# Altium project PCB_Start.PrjPcb
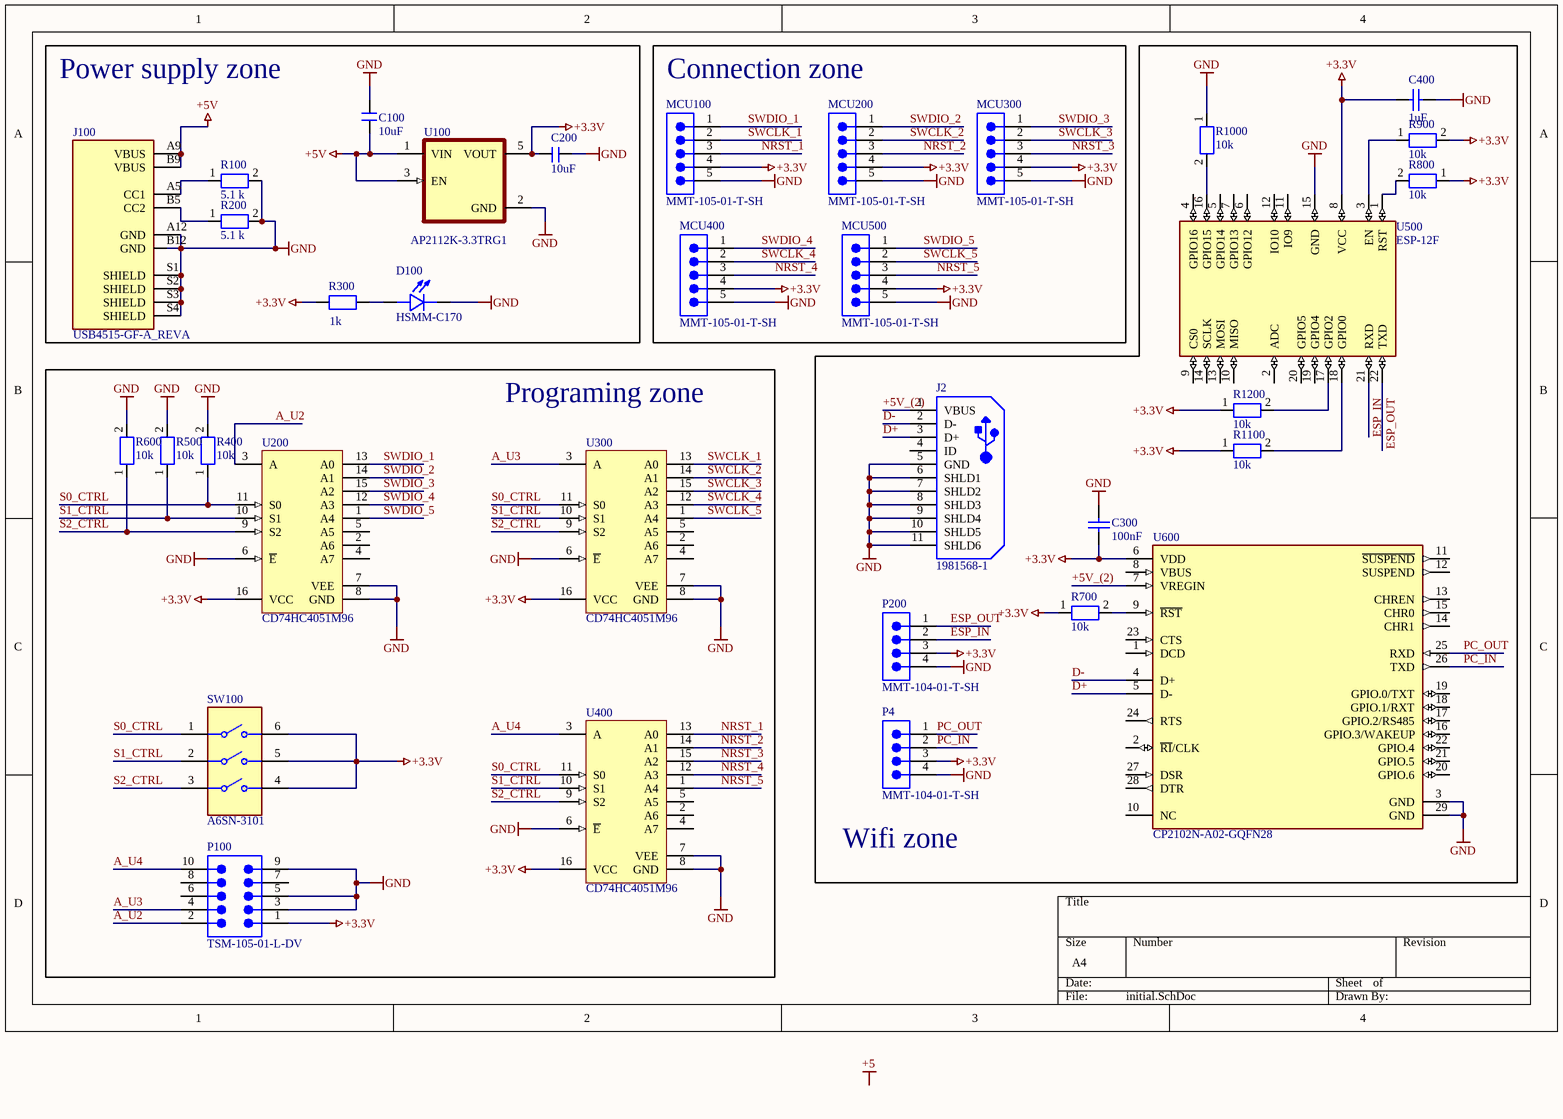
[diagram p0: initial.SchDoc]
1 sheet, 34 parts. Net scope: global (net labels, ports and power ports of the same name join across sheets).
Board file: initial.PcbDoc

## Sheet initial.SchDoc
size A4; SheetNumber: 1; SheetTotal: 1

### Parts
C100  10uF  [CAPC2012X145N]
C200  10uF  [CAPC2012X145N]
C300  100nF  [CAPC2013X135X50LL15T20]
C400  1uF  [CAPC2013X140X50NL20T25]
D100  HSMM-C170  [LED_HSMM-C170]
J2  1981568-1  [TECO-1981568-5_V]
J100  USB4515-GF-A_REVA  [GCT_USB4515-GF-A_REVA]
MCU100  MMT-105-01-T-SH  [SMTC-MMT-105-01-X-SH]
MCU200  MMT-105-01-T-SH  [SMTC-MMT-105-01-X-SH]
MCU300  MMT-105-01-T-SH  [SMTC-MMT-105-01-X-SH]
MCU400  MMT-105-01-T-SH  [SMTC-MMT-105-01-X-SH]
MCU500  MMT-105-01-T-SH  [SMTC-MMT-105-01-X-SH]
P4  MMT-104-01-T-SH  [SMTC-MMT-104-01-X-SH]
P100  TSM-105-01-L-DV  [SMTC-TSM-105-01-X-DV]
P200  MMT-104-01-T-SH  [SMTC-MMT-104-01-X-SH]
R100  5.1 k  [FP-KTR10-IPC_B]
R200  5.1 k  [FP-KTR10-IPC_B]
R300  1k  [RESC2012X60N]
R400  10k  [FP-CRGP0805-IPC_A]
R500  10k  [FP-CRGP0805-IPC_A]
R600  10k  [FP-CRGP0805-IPC_A]
R700  10k  [FP-CRGP0805-IPC_A]
R800  10k  [FP-CRGP0805-IPC_A]
R900  10k  [FP-CRGP0805-IPC_A]
R1000  10k  [FP-CRGP0805-IPC_A]
R1100  10k  [FP-CRGP0805-IPC_A]
R1200  10k  [FP-CRGP0805-IPC_A]
SW100  A6SN-3101  [FP-A6SN-3101-MFG]
U100  AP2112K-3.3TRG1  [SOT95P285X140-5N]
U200  CD74HC4051M96  [D0016A_M]
U300  CD74HC4051M96  [D0016A_M]
U400  CD74HC4051M96  [D0016A_M]
U500  ESP-12F  [ESP-12F]
U600  CP2102N-A02-GQFN28  [FP-CP2102N-A02-GQFN28-MFG]

### Blocks framed on the sheet
Wifi zone: C300 C400 J2 P4 P200 R700 R800 R900 R1000 R1100 R1200 U500 U600
Programing zone: P100 R400 R500 R600 SW100 U200 U300 U400

### Nets
+3.3V: C200.1 C300.1 C400.2 MCU100.4 MCU200.4 MCU300.4 MCU400.4 MCU500.4 P4.3 P100.1 P200.3 R300.1 R700.1 R800.1 R900.2 R1100.1 R1200.1 SW100.4 SW100.5 SW100.6 U100.5(VOUT) U200.16(VCC) U300.16(VCC) U400.16(VCC) U500.8(VCC) U600.6(VDD)
+5V: C100.2 J100.A9(VBUS) J100.B9(VBUS) U100.1(VIN) U100.3(EN)
GND: C100.1 C200.2 C300.2 C400.1 D100.C J2.5(GND) J2.6(SHLD1) J2.7(SHLD2) J2.8(SHLD3) J2.9(SHLD4) J2.10(SHLD5) J2.11(SHLD6) J100.A12(GND) J100.B12(GND) J100.S1(SHIELD) J100.S2(SHIELD) J100.S3(SHIELD) J100.S4(SHIELD) MCU100.5 MCU200.5 MCU300.5 MCU400.5 MCU500.5 P4.4 P100.3 P100.5 P100.9 P200.4 R100.2 R200.2 R400.2 R500.2 R600.2 R1000.1 U100.2(GND) U200.6(~{E}) U200.7(VEE) U200.8(GND) U300.6(~{E}) U300.7(VEE) U300.8(GND) U400.6(~{E}) U400.7(VEE) U400.8(GND) U500.15(GND) U600.3(GND) U600.29(GND)
+5V_(2): J2.1(VBUS) U600.7(VREGIN)
A_U2: P100.2 U200.3(A)
A_U3: P100.4 U300.3(A)
A_U4: P100.10 U400.3(A)
D+: J2.3(D+) U600.5(D-)
D-: J2.2(D-) U600.4(D+)
ESP_IN: P200.2 U500.21(RXD)
ESP_OUT: P200.1 U500.22(TXD)
NRST_1: MCU100.3 U400.13(A0)
NRST_2: MCU200.3 U400.14(A1)
NRST_3: MCU300.3 U400.15(A2)
NRST_4: MCU400.3 U400.12(A3)
NRST_5: MCU500.3 U400.1(A4)
PC_IN: P4.2 U600.26(TXD)
PC_OUT: P4.1 U600.25(RXD)
S0_CTRL: R400.1 SW100.1 U200.11(S0) U300.11(S0) U400.11(S0)
S1_CTRL: R500.1 SW100.2 U200.10(S1) U300.10(S1) U400.10(S1)
S2_CTRL: R600.1 SW100.3 U200.9(S2) U300.9(S2) U400.9(S2)
SWCLK_1: MCU100.2 U300.13(A0)
SWCLK_2: MCU200.2 U300.14(A1)
SWCLK_3: MCU300.2 U300.15(A2)
SWCLK_4: MCU400.2 U300.12(A3)
SWCLK_5: MCU500.2 U300.1(A4)
SWDIO_1: MCU100.1 U200.13(A0)
SWDIO_2: MCU200.1 U200.14(A1)
SWDIO_3: MCU300.1 U200.15(A2)
SWDIO_4: MCU400.1 U200.12(A3)
SWDIO_5: MCU500.1 U200.1(A4)
NetD100_A: D100.A R300.2
NetJ100_A5: J100.A5(CC1) R100.1
NetJ100_B5: J100.B5(CC2) R200.1
NetR700_2: R700.2 U600.9(~{RST})
NetR800_2: R800.2 U500.1(RST)
NetR900_1: R900.1 U500.3(EN)
NetR1000_2: R1000.2 U500.16(GPIO15)
NetR1100_2: R1100.2 U500.18(GPIO0)
NetR1200_2: R1200.2 U500.17(GPIO2)

Not connected (* = marked no-connect by the designer): J2 4(ID); P100 6 7 8; U200 2(A6) 4(A7) 5(A5); U300 2(A6) 4(A7) 5(A5); U400 2(A6) 4(A7) 5(A5); U500 2(ADC) 4(GPIO16) 5(GPIO14) 6(GPIO12) 7(GPIO13) 9(CS0) 10(MISO) 11(IO9) 12(IO10) 13(MOSI) 14(SCLK) 19(GPIO4) 20(GPIO5); U600 1(DCD) 2(~{RI}/CLK) 8(VBUS) 10(NC) 11(~{SUSPEND}) 12(SUSPEND) 13(CHREN) 14(CHR1) 15(CHR0) 16(GPIO.3/WAKEUP) 17(GPIO.2/RS485) 18(GPIO.1/RXT) 19(GPIO.0/TXT) 20(GPIO.6) 21(GPIO.5) 22(GPIO.4) 23(CTS) 24(RTS) 27(DSR) 28(DTR)

### Notes on the sheet
- Power supply zone
- Connection zone
- Labels drawn without touching a wire or pin: +5

### Library data of the parts
C100 C200 = CL21A106KAYNNNE: 10 ÂµF Â±10% 25V Ceramic Capacitor X5R 0805 (2012 Metric); MF: Samsung; SnapEDA_Link: https://www.snapeda.com/parts/CL21A106KAYNNNE/Samsung/view-part/?ref=snap; Package: SMD-2 Samsung; Value: *; MP: CL21A106KAYNNNE; Check_prices: https://www.snapeda.com/parts/CL21A106KAYNNNE/Samsung/view-part/?ref=eda
C300 = CMP-2007-03441-1: Manufacturer: Vitramon; Part Number: VJ0805Y104KXJCW1BC
C400 = CMP-2007-04663-1: Part Number: 0805YD105MAT2A; Manufacturer: AVX Interconnect / Elco
J2 = CMP-2000-05408-1: Micro USB Receptacle Standard Type B Assy, 5-Pin SMD, RoHS, Tape and Reel; Manufacturer: TE Connectivity; Body Orientation: RightAngle; Number of Ports: 1Port; Number of Contacts: 5POS; Gender: RCP; Voltage Rating Max: 30VAC; Product Depth (mm): 5.6mm; Pitch (mm): 0.65mm; Current Rating (Max): 1/ContactA; Product Length (mm): 8mm; Product Height (mm): 3mm; Operating Temperature Max Deg. C: 85C; Datasheet URL: http://www.mouser.com/ds/2/418/NG_CD_1981568_E2-621296.pdf; Termination Method: Solder; Number of Terminals: 5; Operating Temp Range: -55Cto85C; Mounting Style: SurfaceMount; Manufacturer URL: http://www.te.com/; Contact Material: CopperAlloy; Packaging: TapeandReel; Datasheet Version: Rev. E2, 08/2015; Operating Temperature Min Deg. C: -55C; Housing Material: Thermoplastic; Type: MicroUSB; Contact Plating: GoldOverNickel
J100 = USB4515-GF-A_REVA: Type C USB Charging Connector; MF: Global Connector Technology; SnapEDA_Link: https://www.snapeda.com/parts/USB4515-GF-A/Global+Connector+Technology/view-part/?ref=snap; Package: None; Check_prices: https://www.snapeda.com/parts/USB4515-GF-A/Global+Connector+Technology/view-part/?ref=eda; Value: *; Digi-Key_Part_Number: 2073-USB4515-GF-ATR-ND; MP: USB4515-GF-A
MCU100 MCU200 MCU300 MCU400 MCU500 = CMP-1029-00060-1: Horizontal Surface Mount Header, -55 to 105 degC, 2 mm Pitch, 5-Pin, Male, RoHS; Manufacturer: Samtec; Pitch: 2 mm; PartNumber: MMT-105-01-T-SH; ComponentLink3URL: http://www.samtec.com/documents/webfiles/cpdf/MMT-1XX-XX-XX-XX-XX-XXX-X-XX-MKT.pdf; PackageDescription: 2mm Horizontal Terminal Surface Mount Strip ASSEM; RoHS: True; PackageVersion: CY, 12/2000; Orientation: Horizontal; Temperature Range: -55 to 105 degC; Mounting Technology: Surface Mount; ComponentLink2Description: Datasheet; PackageReference: MMT-105-01-X-SH; ComponentLink3Description: Package Specification; DatasheetVersion: F-214; ComponentLink1Description: Manufacturer URL; ComponentLink2URL: http://d2a072wq521u33.cloudfront.net/catalog_english//MMT_SM.PDF; ComponentLink1URL: http://www.samtec.com
P4 P200 = CMP-1029-00049-1: Horizontal Surface Mount Header, -55 to 105 degC, 2 mm Pitch, 4-Pin, Male, RoHS; Manufacturer: Samtec; Pitch: 2 mm; Orientation: Horizontal; RoHS: True; Mounting Technology: Surface Mount; PackageReference: MMT-104-01-X-SH; ComponentLink2URL: http://d2a072wq521u33.cloudfront.net/catalog_english//MMT_SM.PDF; Temperature Range: -55 to 105 degC; PartNumber: MMT-104-01-T-SH; ComponentLink1Description: Manufacturer URL; PackageVersion: CY, 12/2000; ComponentLink1URL: http://www.samtec.com; ComponentLink3Description: Package Specification; ComponentLink3URL: http://www.samtec.com/documents/webfiles/cpdf/MMT-1XX-XX-XX-XX-XX-XXX-X-XX-MKT.pdf; PackageDescription: 2mm Horizontal Terminal Surface Mount Strip ASSEM; DatasheetVersion: F-214; ComponentLink2Description: Datasheet
P100 = CMP-1024-00233-1: 0.025" SQ Post Header, Surface Mount, Vertical, -55 to 125 degC, 2.54 mm Pitch, 10-Pin, Male, RoHS; Manufacturer: Samtec; Pitch: 2.54 mm; ComponentLink1URL: http://www.samtec.com; DatasheetVersion: F-214; ComponentLink3URL: http://www.samtec.com/documents/webfiles/cpdf/TSM-1XX-XX-XXX-XX-X-XXX-X-MKT.pdf; Temperature Range: -55 to 125 degC; PackageDescription: Double Row Gullwing ASM; PartNumber: TSM-105-01-L-DV; ComponentLink2URL: http://www.samtec.com/documents/webfiles/pdf/TSM.PDF; ComponentLink2Description: Datasheet; Mounting Technology: Surface Mount; PackageVersion: DJ, 4/1991; RoHS: True; ComponentLink3Description: Package Specification; PackageReference: TSM-105-01-X-DV; Orientation: Vertical; ComponentLink1Description: Manufacturer URL
R100 R200 = CMP-08839-031572-1: Res Thick Film 0805 5.1kΩ 1% 0.125W ±100ppm/°C Automotive Paper T/R; Max Power Dissipation: 125mW; Resistance: 5.1kR; Number of Terminations: 2; Features: Automotive AEC-Q200; Height: 0.026inch; Length: 0.079inch; Case/Package: 0805; Packaging: Tape and Reel; Case Code (Imperial): 0805; Min Operating Temperature: -55°C; Tolerance: 1%; Width: 0.049inch; Max Operating Temperature: 155°C; Resistor Type: Thick Film; Temperature Coefficient: 100ppm/°C; Series: KTR; Package Quantity: 5000; Case Code (Metric): 2012; RoHS Compliant: Yes
R300 = CRS0805-JX-102ELF: 1 kOhms Â±5% 0.25W, 1/4W Chip Resistor 0805 (2012 Metric) High Voltage, Pulse Withstanding Thick Film; MF: Bourns; MP: CRS0805-JX-102ELF; SnapEDA_Link: https://www.snapeda.com/parts/CRS0805-JX-102ELF/Bourns/view-part/?ref=snap; Availability: In Stock; Package: 2012 Stackpole; Check_prices: https://www.snapeda.com/parts/CRS0805-JX-102ELF/Bourns/view-part/?ref=eda; Value: *; Purchase-URL: https://pricing.snapeda.com/search/part/CRS0805-JX-102ELF/?ref=eda; Price: None
R400 R500 R600 R700 R800 R900 R1000 R1100 R1200 = CMP-03211-006861-1: CRGP 0805 10K 1%; Manufacturer Part Number: CRGP0805F10K; Manufacturer: TE; Power Rating: 0.33W; Voltage Rating: 150V; Value: 10KΩ; Tolerance: 0.01; Temperature Coefficient: ±100ppm/°C; ComponentLink2URL: https://www.mouser.com/datasheet/2/418/NG_DS_9-1773463-9_A-1358566.pdf; Temperature Range Low: -55°C; Ipc Land Pattern Name: RESC200125X55; Device Class L2: Resistors; Automotive: No; Device Class L3: Chip SMD Resistors; Composition: Thick Film; Temperature Range High: +155°C; Temperature: -55°C to +155°C; Height: 0.65mm; Series: CRGP; RoHS: TRUE; Device Class L1: Passive Components; Octopart: https://octopart.com/crgp0805f10k-te+connectivity-91018782; Package: CRGP0805; Digikey Description: CRGP 0805 10K 1%; Ambient Temperature Range High: +70°C; Lead Free: Yes; ComponentLink2Description: Datasheet; Category: Res; Resistance: 10KΩ
SW100 = CMP-08827-000007-1: SWITCH SLIDE DIP SPST 25MA 24V; Manufacturer: Omron Electronics Inc-EMC Div; Electromechanical Life: 1000Cycles; Contact Resistance: 200mΩ; Standoff Height: 0.7mm; Number Of Circuits: 3; Device Class L2: Switches; Device Class L3: DIP Switches; Ambient Temperature Range High: +85°C; RoHS: TRUE; Temperature Range High: +85°C; Ambient Temperature Range Low: -30°C; ComponentLink2URL: https://omronfs.omron.com/en_US/ecb/products/pdf/en-a6sn.pdf; Category: Switch; Temperature Range Low: -30°C; Digikey Description: SWITCH SLIDE DIP SPST 25MA 24V; Package: A6SN-3101; Mouser Description: DIP Switches / SIP Switches 3P Knife-Edge, 2.3mm Slide SMT Flat-Act; Device Class L1: Electromechanical; Current Rating: 25mA; Lead Free: Yes; ComponentLink2Description: Datasheet; Throw Configuration: SPST; Voltage Rating Dc: 24V; Height: 4.55mm; Octopart: https://octopart.com/a6sn-3101-omron-55396000; Automotive: No; Manufacturer Part Number: A6SN-3101; Temperature: -30°C to +85°C
U100 = AP2112K-3.3TRG1: Linear Voltage Regulator IC Positive Fixed 1 Output 600mA SOT-25; MF: Diodes Inc.; Value: *; Purchase-URL: https://pricing.snapeda.com/search/part/AP2112K-3.3TRG1/?ref=eda; Package: SOT-753 Diodes Inc.; Availability: In Stock; Check_prices: https://www.snapeda.com/parts/AP2112K-3.3TRG1/Diodes+Inc./view-part/?ref=eda; Price: None; SnapEDA_Link: https://www.snapeda.com/parts/AP2112K-3.3TRG1/Diodes+Inc./view-part/?ref=snap; MP: AP2112K-3.3TRG1
U200 U300 U400 = CMP-1575-00036-4: High Speed CMOS 8-Channel Analog Multiplexer/Demultiplexer, D0016A, LARGE T&R; Manufacturer: Texas Instruments; Crosstalk: Yes; Ron(Max)(Ohms): 130; VCC(Min)(V): 2; Bandwidth(Max)(MHz): 180; VCC(Max)(V): 6; Rating: Catalog; Configuration: 1 X 1：8 MUX; Ron(Typ)(Ohms): 45; Generic Part Number: CD74HC4051; Output Type: CMOS; Operating Temperature Range(C): -55 to 125; DatasheetVersion: SCHS122J; Code_JEDEC: MS-012 variation AC; PackageReference: D0016A; PackageVersion: http://www.ti.com/lit/ml/mpds178g/mpds178g.pdf
U500 = ESP-12F: WiFi Module; MF: AI-Thinker; SnapEDA_Link: https://www.snapeda.com/parts/ESP-12F/AI-Thinker/view-part/?ref=snap; Package: Package; Value: *; MP: ESP-12F; Check_prices: https://www.snapeda.com/parts/ESP-12F/AI-Thinker/view-part/?ref=eda
U600 = CMP-08093-000005-1: IC USB TO UART BRIDGE QFN28
D100 = HSMM-C170: Package: None; Price: None; Value: *; MP: HSMM-C170; Availability: Unavailable